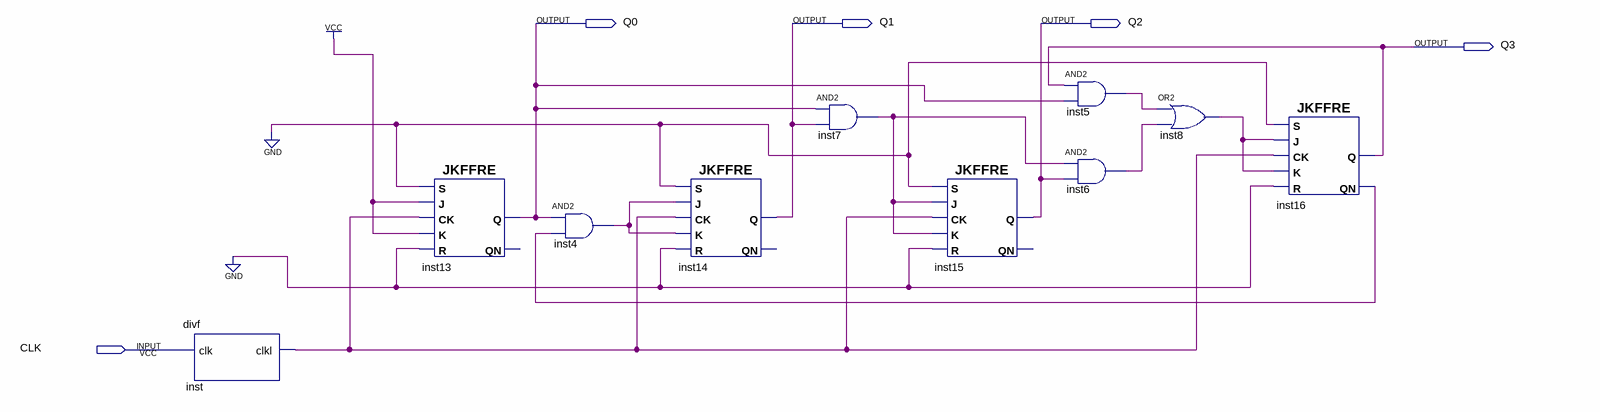
[diagram p0: schematic sheet]
// Quartus schematic Practica1.bdf as structural Verilog: 10 symbols, 5 pins
module Practica1 (
  input  CLK,
  output Q0,
  output Q1,
  output Q2,
  output Q3
);

  wire inst4_out, inst5_out, inst6_out, inst7_out, inst8_out, inst16_qn, inst_clkl;

  divf inst (.clk(CLK), .clkl(inst_clkl));
  JKFFRE inst13 (.R(1'b0), .K(1'b1), .CK(inst_clkl), .J(1'b1), .S(1'b0), .Q(Q0));  // open: QN
  and inst4 (inst4_out, Q0, inst16_qn);
  JKFFRE inst14 (.R(1'b0), .K(inst4_out), .CK(inst_clkl), .J(inst4_out), .S(1'b0), .Q(Q1));  // open: QN
  and inst7 (inst7_out, Q0, Q1);
  JKFFRE inst15 (.R(1'b0), .K(inst7_out), .CK(inst_clkl), .J(inst7_out), .S(1'b0), .Q(Q2));  // open: QN
  and inst5 (inst5_out, Q3, Q0);
  and inst6 (inst6_out, inst7_out, Q2);
  or inst8 (inst8_out, inst5_out, inst6_out);
  JKFFRE inst16 (.R(1'b0), .K(inst8_out), .CK(inst_clkl), .J(inst8_out), .S(1'b0), .QN(inst16_qn), .Q(Q3));
endmodule
